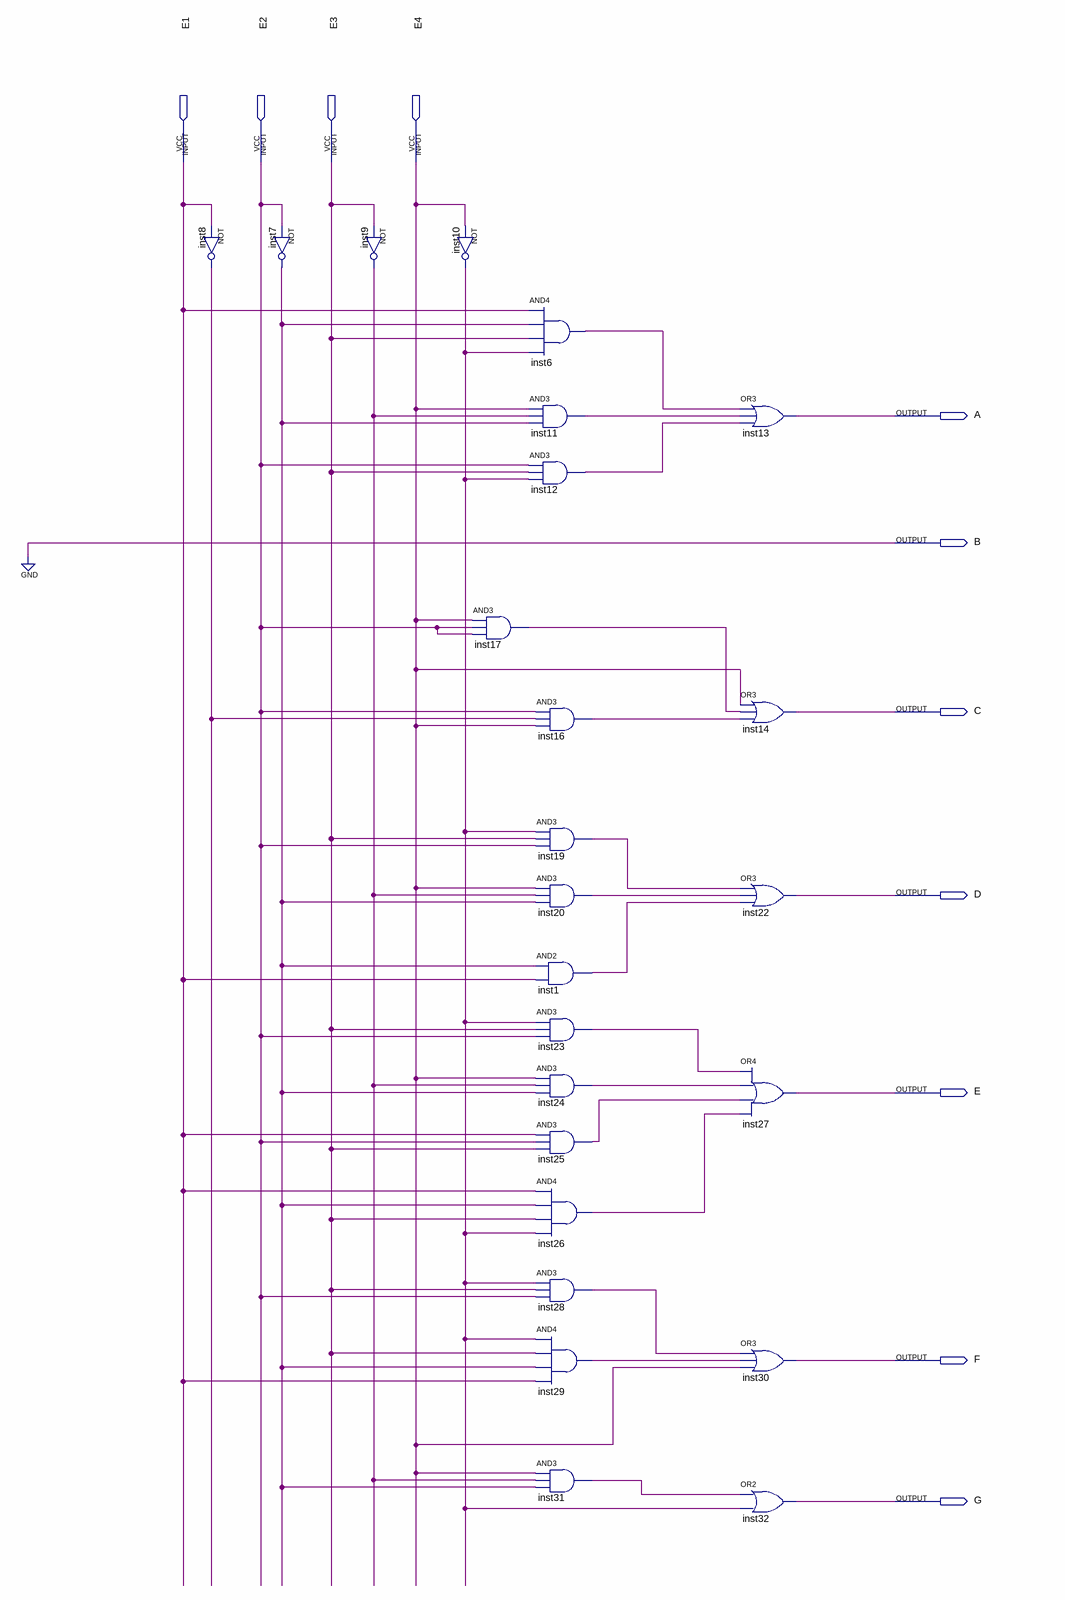
[diagram p0: schematic sheet]
// Quartus schematic dezena_max3.bdf as structural Verilog: 25 symbols, 11 pins
module dezena_max3 (
  input  E1,
  input  E2,
  input  E3,
  input  E4,
  output A,
  output B,
  output C,
  output D,
  output E,
  output F,
  output G
);

  wire inst1_out, inst6_out, inst7_out, inst8_out, inst9_out, inst10_out, inst11_out, inst12_out, inst16_out,
       inst17_out, inst19_out, inst20_out, inst23_out, inst24_out, inst25_out, inst26_out, inst28_out,
       inst29_out, inst31_out;

  not inst8 (inst8_out, E1);
  not inst7 (inst7_out, E2);
  not inst9 (inst9_out, E3);
  not inst10 (inst10_out, E4);
  and inst17 (inst17_out, E4, E2, E2);
  and inst6 (inst6_out, E1, inst7_out, E3, inst10_out);
  and inst11 (inst11_out, E4, inst9_out, inst7_out);
  and inst12 (inst12_out, E2, E3, inst10_out);
  and inst16 (inst16_out, E2, inst8_out, E4);
  and inst19 (inst19_out, inst10_out, E3, E2);
  and inst20 (inst20_out, E4, inst9_out, inst7_out);
  and inst1 (inst1_out, inst7_out, E1);
  and inst23 (inst23_out, inst10_out, E3, E2);
  and inst24 (inst24_out, E4, inst9_out, inst7_out);
  and inst25 (inst25_out, E1, E2, E3);
  and inst26 (inst26_out, E1, inst7_out, E3, inst10_out);
  and inst28 (inst28_out, inst10_out, E3, E2);
  and inst29 (inst29_out, inst10_out, E3, inst7_out, E1);
  and inst31 (inst31_out, E4, inst9_out, inst7_out);
  or inst13 (A, inst6_out, inst11_out, inst12_out);
  or inst14 (C, E4, inst17_out, inst16_out);
  or inst22 (D, inst19_out, inst20_out, inst1_out);
  or inst27 (E, inst23_out, inst24_out, inst25_out, inst26_out);
  or inst30 (F, inst28_out, inst29_out, E4);
  or inst32 (G, inst31_out, inst10_out);

  assign B = 1'b0;
endmodule
